# EasyEDA schematic RC-ESC_2020-12-18_19-57-09.json
TITLE: Pro Micro Motor control; REV: 1.0; Date: 2020-12-05; Sheet: 1/1; Drawn By: dehein; Company: Your Company
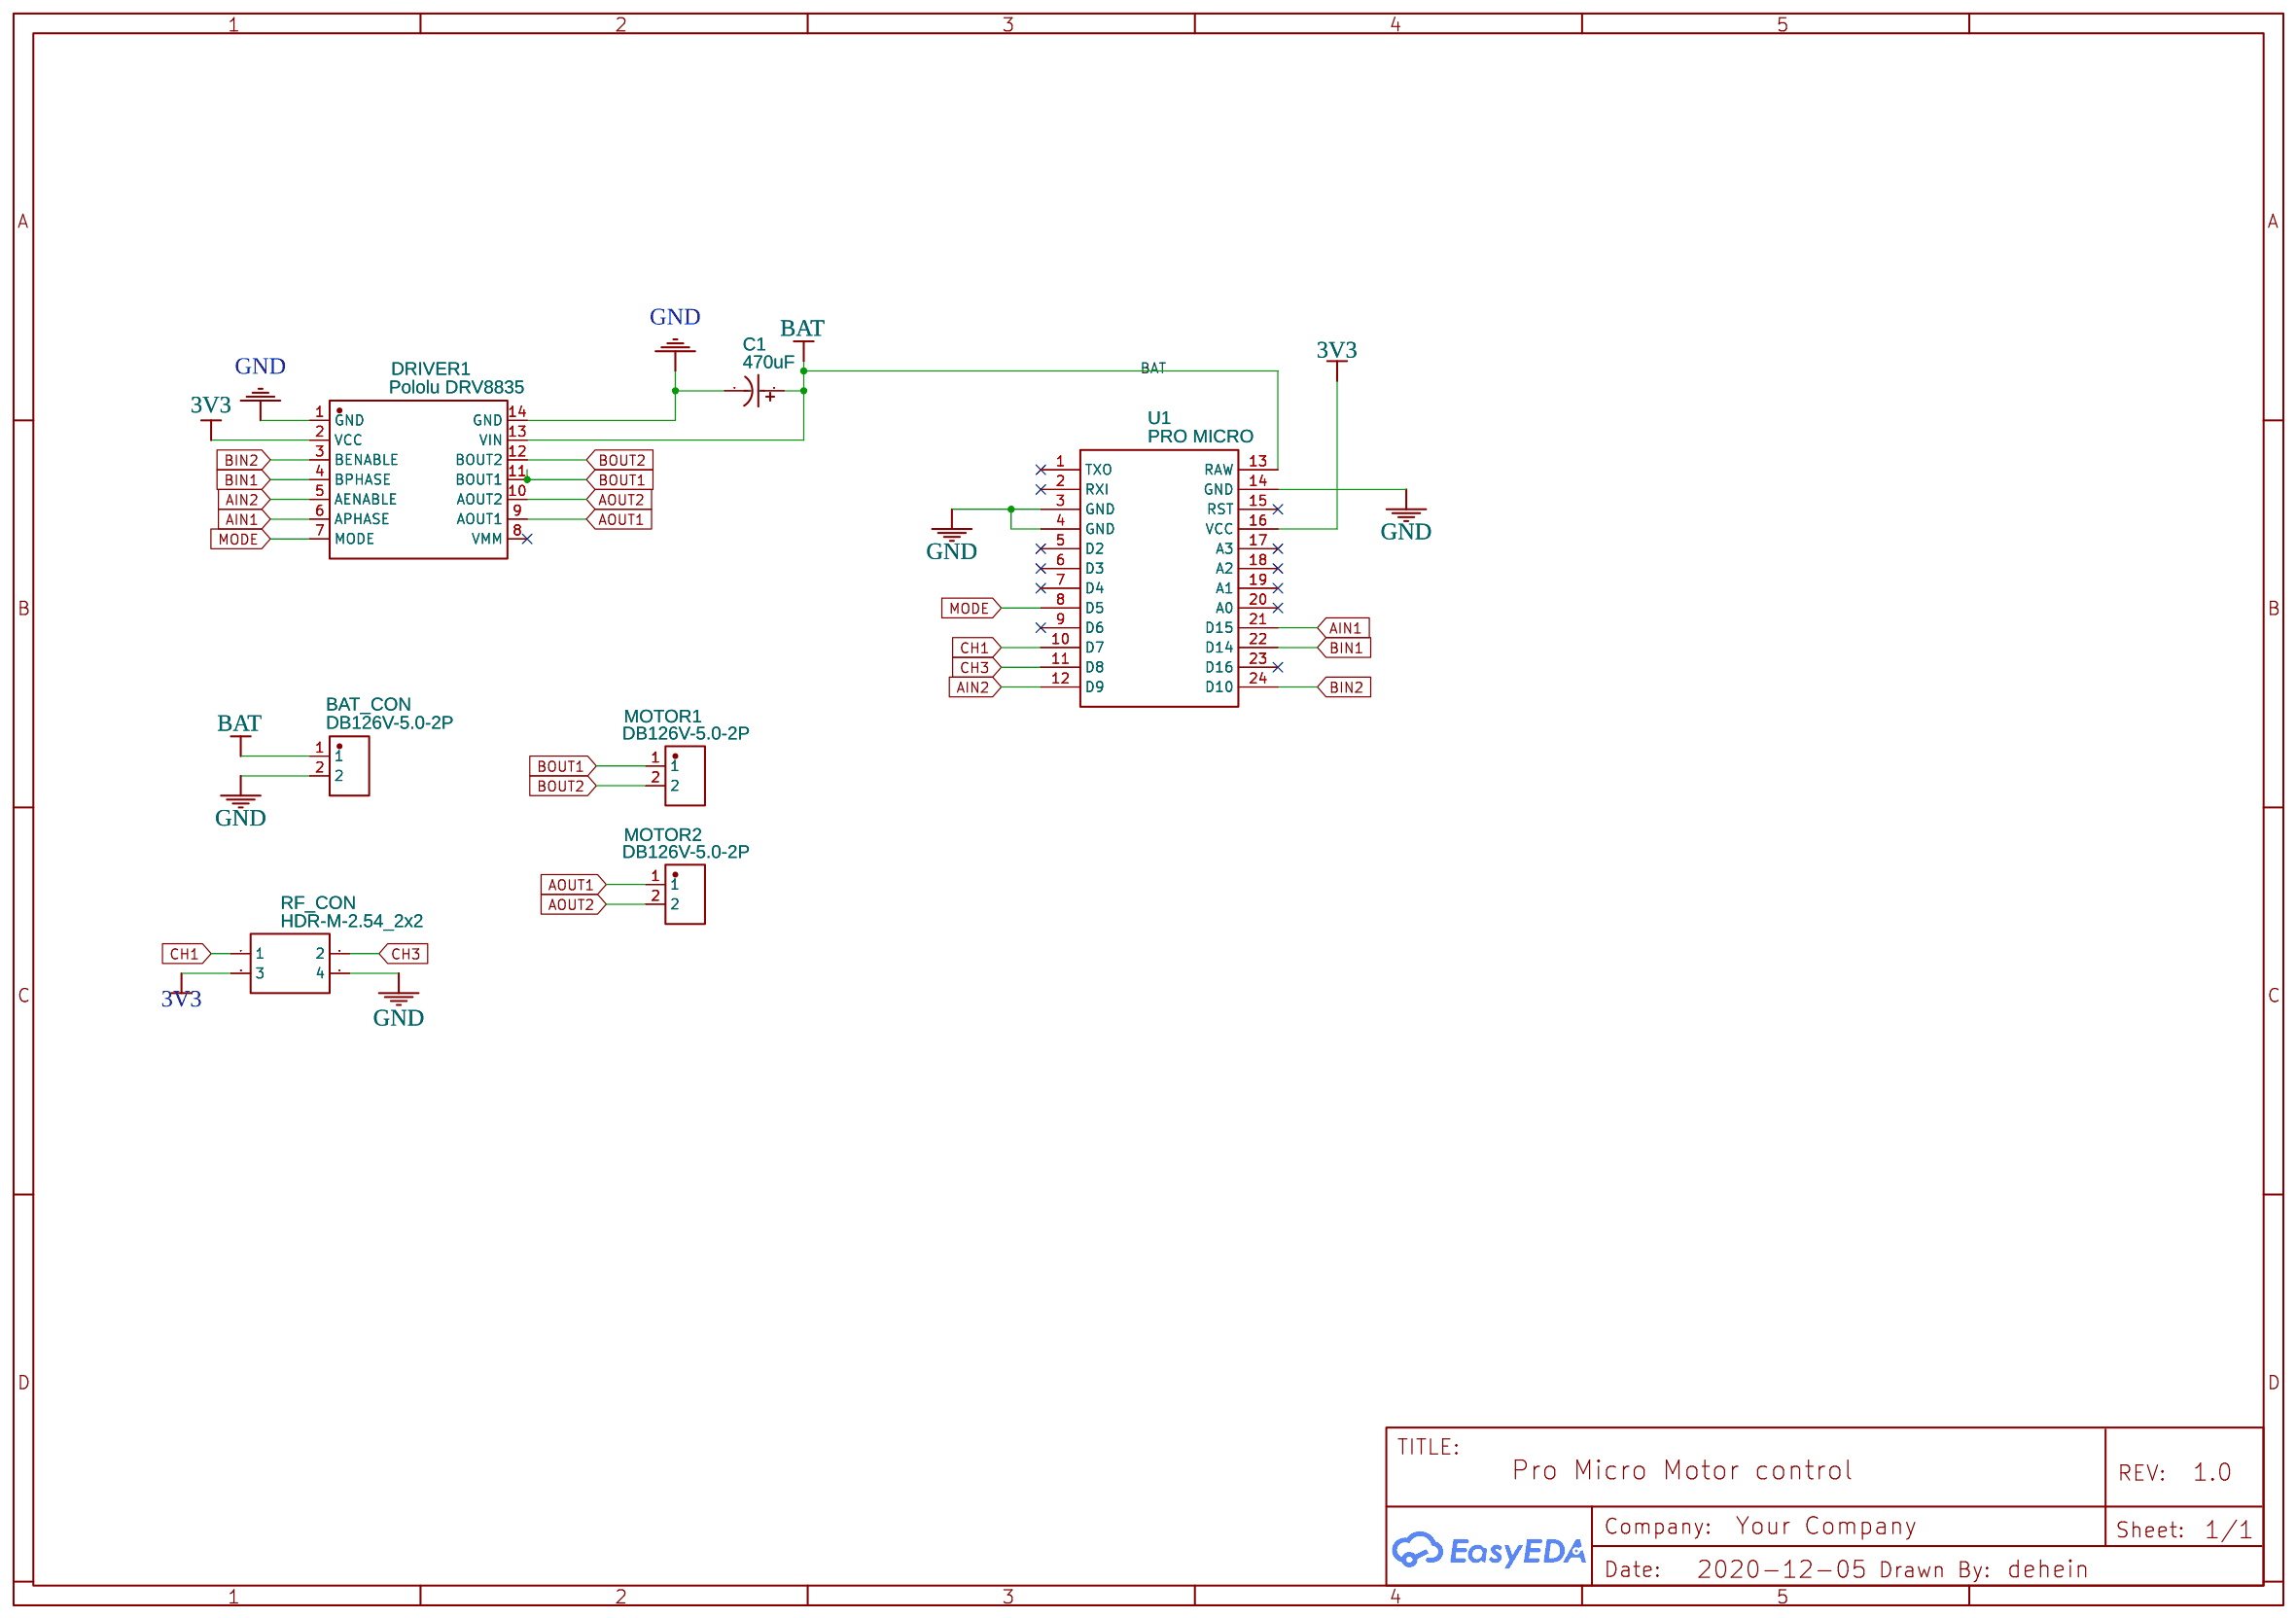
[diagram p0: schematic sheet]

## Parts
BAT_CON  DB126V-5.0-2P  [CONN-TH_2P-P5.00_L7.8-W10.0]
C1  470uF  [CAP-TH_BD8.0-P3.50-D1.0-FD]
DRIVER1  Pololu DRV8835  [POLOLU_DRV8835]
MOTOR1  DB126V-5.0-2P  [CONN-TH_2P-P5.00_L7.8-W10.0]
MOTOR2  DB126V-5.0-2P  [CONN-TH_2P-P5.00_L7.8-W10.0]
RF_CON  HDR-M-2.54_2x2  [HDR-M-2.54_2X2]
U1  PRO MICRO  [PRO MICRO]

## Library data of the parts
BAT_CON MOTOR1 MOTOR2 = DB126V-5.0-2P: Supplier: LCSC; Supplier Part: C395849; Manufacturer: DIBO; Contributor: LCSC
C1 = 470uF 25V 8*12Black high frequency: Supplier: LCSC; Manufacturer: ValuePro; Supplier Part: C44602
DRIVER1 = Pololu DRV8835: Manufacturer: Pololu; Manufacturer Part: 2135; link: https://www.pololu.com/product/2135; Contributor: panerist
RF_CON = HDR-M-2.54_2x2: Supplier Part: C66690; Supplier: LCSC; Manufacturer: BOOMELE; Manufacturer Part: Double Rows2.54mm2*2pHeaders  Pins; Contributor: LCEDA_Lib
U1 = PRO MICRO: Contributor: red-hara

## Nets
3V3: DRIVER1.2(VCC) RF_CON.3 U1.16(VCC)
GND: BAT_CON.2 C1.2 DRIVER1.1(GND) DRIVER1.14(GND) RF_CON.4 U1.3(GND) U1.4(GND) U1.14(GND)
AIN1: DRIVER1.6(APHASE) U1.21(D15)
AIN2: DRIVER1.5(AENABLE) U1.12(D9)
AOUT1: DRIVER1.9(AOUT1) MOTOR2.1
AOUT2: DRIVER1.10(AOUT2) MOTOR2.2
BAT: BAT_CON.1 C1.1 DRIVER1.13(VIN) U1.13(RAW)
BIN1: DRIVER1.4(BPHASE) U1.22(D14)
BIN2: DRIVER1.3(BENABLE) U1.24(D10)
BOUT1: DRIVER1.11(BOUT1) MOTOR1.1
BOUT2: DRIVER1.12(BOUT2) MOTOR1.2
CH1: RF_CON.1 U1.10(D7)
CH3: RF_CON.2 U1.11(D8)
MODE: DRIVER1.7(MODE) U1.8(D5)

Not connected (* = marked no-connect by the designer): DRIVER1 8(VMM)*; U1 1(TXO)* 2(RXI)* 5(D2)* 6(D3)* 7(D4)* 9(D6)* 15(RST)* 17(A3)* 18(A2)* 19(A1)* 20(A0)* 23(D16)*
